# EAGLE design SparkFun_CP2103_Breakout (EAGLE 7.2.0)
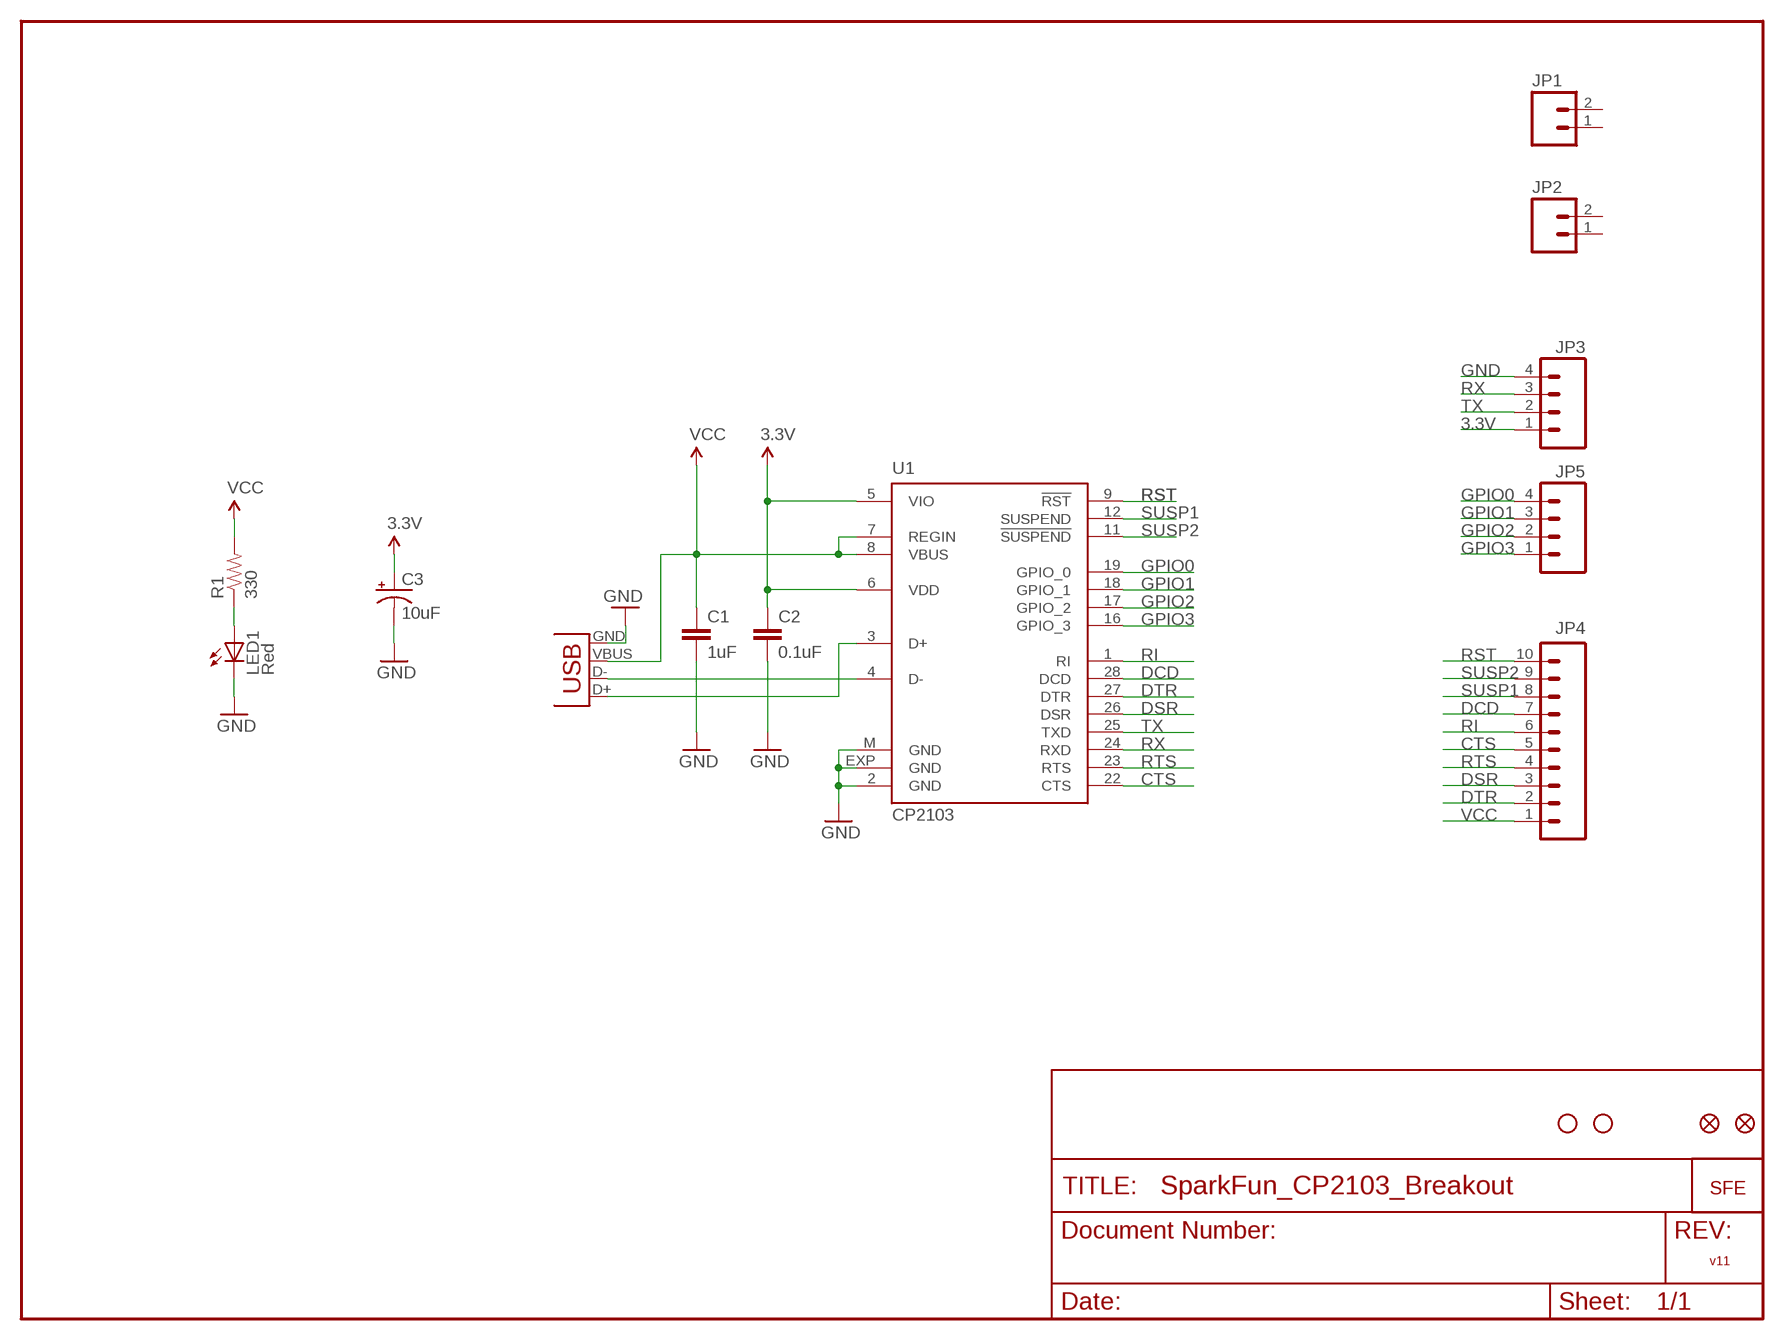
[diagram p0: schematic, sheet 1]

## Parts
C1  1uF  CAP0402  [C0402]
C2  0.1uF  CAP0402  [C0402]
C3  10uF  CAP_POL1206  [EIA3216]
JP1  M02PTH  [1X02]
JP2  M02PTH  [1X02]
JP3  M04PTH  [1X04]
JP4  M100.1  [1X10]
JP5  M04PTH  [1X04]
LED1  Red  LED1206  [LED-1206]
R1  330  RESISTOR0402  [C0402]
U1  CP2103  CP2103_USB_UART  [MLP28]
U$1  LOGO-SFENEW  [SFE-NEW-WEBLOGO]
U$2  FIDUCIAL1X2  [FIDUCIAL-1X2]
U$3  FIDUCIAL1X2  [FIDUCIAL-1X2]
U$6  STAND-OFF  [STAND-OFF]
U$7  STAND-OFF  [STAND-OFF]
X1  USBPTH  [USB-B-PTH]

## Nets
3.3V: C2.1 C3.A(+) JP3.1 U1.5(VIO) U1.6(VDD)
CTS: JP4.5 U1.22(CTS)
D+: U1.3(D+) X1.D+
D-: U1.4(D-) X1.D-
DCD: JP4.7 U1.28(DCD)
DSR: JP4.3 U1.26(DSR)
DTR: JP4.2 U1.27(DTR)
GND: C1.2 C2.2 C3.C(-) JP3.4 LED1.C U1.2(GND) U1.EXP(GND) U1.M(GND) X1.GND
GPIO0: JP5.4 U1.19(GPIO_0)
GPIO1: JP5.3 U1.18(GPIO_1)
GPIO2: JP5.2 U1.17(GPIO_2)
GPIO3: JP5.1 U1.16(GPIO_3)
N$3: LED1.A R1.1
RI: JP4.6 U1.1(RI)
RST: JP4.10 U1.9(!RST)
RTS: JP4.4 U1.23(RTS)
RX: JP3.3 U1.24(RXD)
SUSP1: JP4.8 U1.12(SUSPEND)
SUSP2: JP4.9 U1.11(!SUSPEND)
TX: JP3.2 U1.25(TXD)
VCC: C1.1 JP4.1 R1.2 U1.7(REGIN) U1.8(VBUS) X1.VBUS
Unconnected: JP1.1 JP1.2 JP2.1 JP2.2

## Notes on the sheet
- v11

## Library data of the parts
C1 C2 = SparkFun:CAP: Capacitor Standard 0603 ceramic capacitor, and 0.1" leaded capacitor.
C3 = SparkFun:CAP_POL: Capacitor Polarized These are standard SMD and PTH capacitors. Normally 10uF, 47uF, and 100uF in electrolytic and tantalum varieties. Always verify the external diameter of the through hole cap, it varies with capacity, voltage, and manufacturer. The EIA devices should be standard.
JP1 JP2 = SparkFun:M02: Header 2 Standard 2-pin 0.1" header. Use with straight break away headers (SKU : PRT-00116), right angle break away headers (PRT-00553), swiss pins (PRT-00743), machine pins (PRT-00117), and female headers (PRT-00115). Molex polarized connector foot print use with SKU : PRT-08233 with associated crimp pins and housings.
JP3 JP5 = SparkFun:M04: Header 4 Standard 4-pin 0.1" header. Use with straight break away headers (SKU : PRT-00116), right angle break away headers (PRT-00553), swiss pins (PRT-00743), machine pins (PRT-00117), and female headers (PRT-00115). Molex polarized connector foot print use with SKU : PRT-08231 with associated crimp pins and housings.
JP4 = SparkFun:M10: Header 10 Standard 10-pin 0.1" header. Use with straight break away headers (SKU : PRT-00116), right angle break away headers (PRT-00553), swiss pins (PRT-00743), machine pins (PRT-00117), and female headers (PRT-00115).
LED1 = SparkFun:LED: LEDs Standard schematic elements and footprints for 5mm, 3mm, 1206, and 0603 sized LEDs. 5mm - Spark Fun Electronics SKU : COM-00529 (and others)
R1 = SparkFun:RESISTOR: Resistor Basic schematic elements and footprints for 0603, 1206, and PTH 1/10th watt (small) resistors.
U1 = SparkFun:CP2103_USB_UART: Single-Chip USB to UART Bridge Source: www.silabs.com .. CP2103.pdf. Spark Fun Electronics SKU : COM-00309
U$1 = SparkFun:LOGO-SFE: Spark Fun Electronics PCB Logo This is the standard Spark Fun Electronics PCB logo.
U$2 U$3 = SparkFun:FIDUCIAL: Fiducial Alignment Points Various fiducial points for machine vision alignment.
U$6 U$7 = SparkFun:STAND-OFF: Stand Off This is the mechanical footprint for a #4 phillips button head screw. Use the keepout ring to avoid running the screw head into surrounding components. SKU : PRT-00447
X1 = SparkFun:USB: USB Connectors USB-B-PTH is fully proven SKU : PRT-00139 USB-miniB is fully proven SKU : PRT-00587 USB-A-PCB is untested. USB-A-H is throughly reviewed, but untested. Spark Fun Electronics SKU : PRT-00437 USB-B-SMT is throughly reviewed, but untested. Needs silkscreen touching up. USB-A-S has not been used/tested USB-MB-H has not been used/tested

## Board
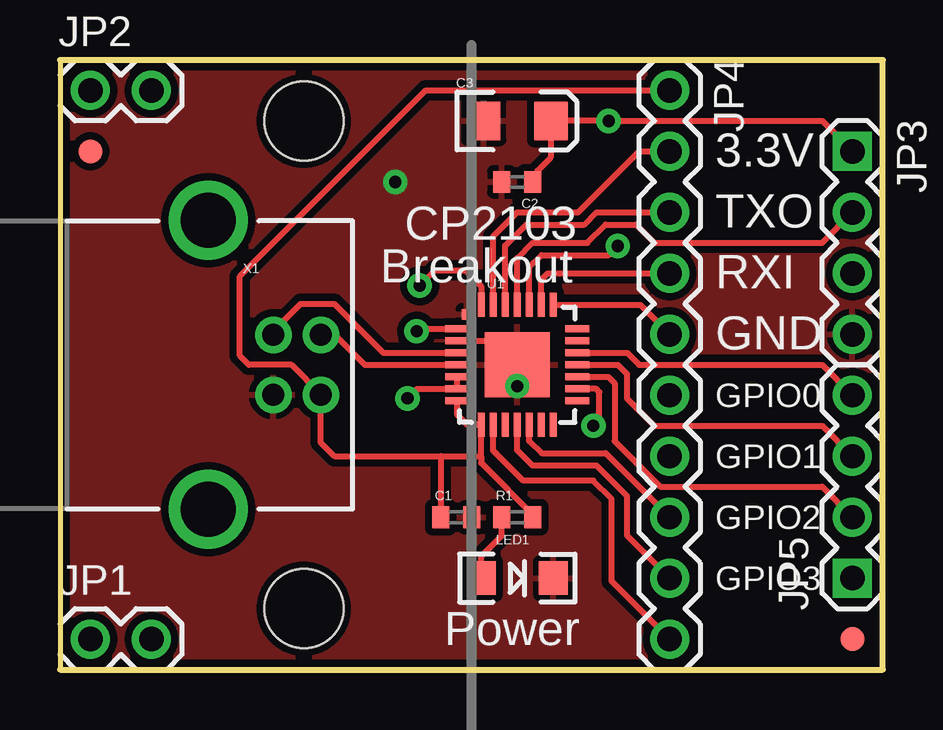
[diagram p1: board, top side]
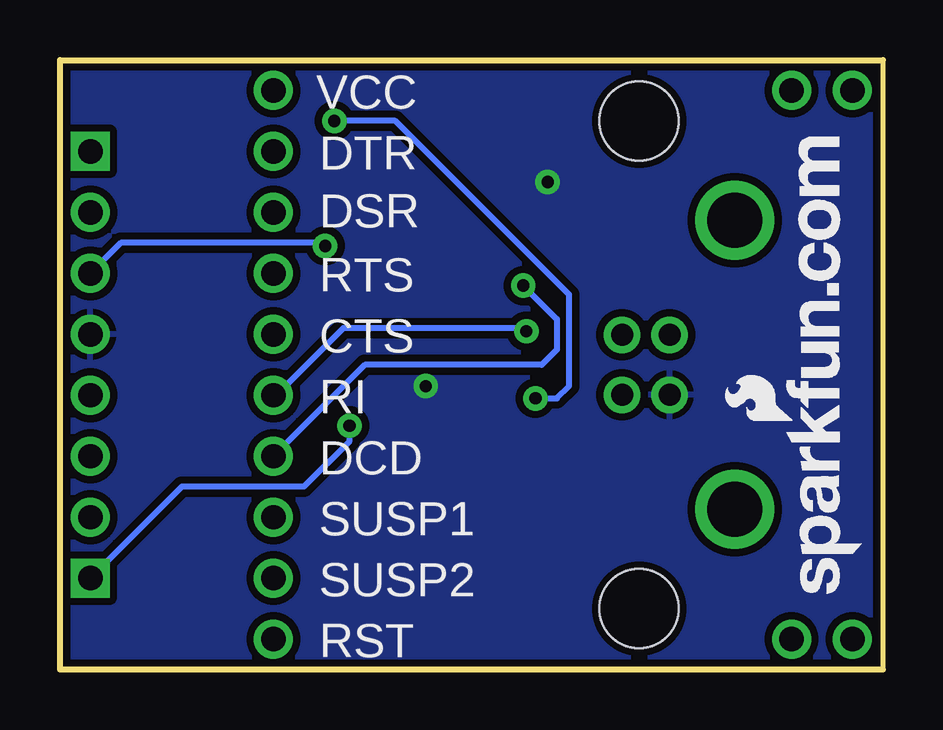
[diagram p2: board, bottom side, seen from below]

Size 34.29 x 25.4 mm. Coordinates in mm from the lower left corner, seen from the top.
Outline: 0,0 34.29,0 34.29,25.4 0,25.4 0,0
Copper layers (1*16): Top 0.035mm / dielectric 1.5mm / Bottom 0.035mm
Design rules "SparkFun": minimum track width 8mil, minimum drill 20mil, track to track 8mil, track to pad 8mil, pad to pad 8mil, via to via 8mil, smd to smd 8mil, copper to edge 10mil, drill to drill 8mil, minimum pad ring 12mil, minimum via ring 10mil, stop-mask expansion 4mil, vias tented up to drill 20mil, thermal gap 10mil

### Footprints (pad centres in the part's own frame; a part is rotated, then mirrored left to right if it is on the bottom)
C0402 = smd 0.7 x 0.9: 1 -0.65,0; 2 0.65,0
EIA3216 = smd 1.4 x 1.6: A 1.4,0; C -1.4,0
1X02 = drill 1.016: 1 0,0; 2 2.54,0
1X04 = drill 1.016 square: 1 0,0 | drill 1.016: 2 2.54,0; 3 5.08,0; 4 7.62,0
1X10 = drill 1.016: 1 0,0; 2 2.54,0; 3 5.08,0; 4 7.62,0; 5 10.16,0; 6 12.7,0; 7 15.24,0; 8 17.78,0; 9 20.32,0; 10 22.86,0
LED-1206 = smd 1.2 x 1.4: A -1.5,0; C 1.5,0
MLP28 = smd 1 x 0.3: 1 -2.5,1.5; 2 -2.5,1; 3 -2.5,0.5; 4 -2.5,0; 5 -2.5,-0.5; 6 -2.5,-1; 7 -2.5,-1.5; 15 2.5,-1.5; 16 2.5,-1; 17 2.5,-0.5; 18 2.5,0; 19 2.5,0.5; 20 2.5,1; 21 2.5,1.5 | smd 0.3 x 1: 8 -1.5,-2.5; 9 -1,-2.5; 10 -0.5,-2.5; 11 0,-2.5; 12 0.5,-2.5; 13 1,-2.5; 14 1.5,-2.5; 22 1.5,2.5; 23 1,2.5; 24 0.5,2.5; 25 0,2.5; 26 -0.5,2.5; 27 -1,2.5; 28 -1.5,2.5 | smd 2.7 x 2.7: EXP 0,0 | smd 0.435 x 0.435: M -2.103,2.103
FIDUCIAL-1X2 = smd 1 x 1: 1 0,0
STAND-OFF = hole 3.302: 0,0
USB-B-PTH = drill 0.914: D+ 0,1.25; D- 1.981,1.25; GND 0,-1.25; VBUS 1.981,-1.25 | drill 2.286: P$1 -2.718,-6.02; P$2 -2.718,6.02

### Placement (x,y rotation side)
C1  16.51,6.35 0 top
C2  19.05,20.32 180 top
C3  19.05,22.86 0 top
JP1  1.27,1.27 0 top
JP2  1.27,24.13 0 top
JP3  33.02,21.59 270 top
JP4  25.4,24.13 270 top
JP5  33.02,3.81 90 top
LED1  19.05,3.81 0 top
R1  19.05,6.35 0 top
U1  19.05,12.7 0 top
U$1  0.89,3.17 90 bottom
U$2  33.02,1.27 0 top
U$3  1.27,21.59 0 top
U$6  10.16,2.54 0 top
U$7  10.16,22.86 0 top
X1  8.89,12.7 0 top

### Tracks (layer width: path | path; a pad name or v marks a point on that pad's centre or on a via)
3.3V  (via drill 0.51)
  Top 0.254: C2.1 19.9,20.79 20.45,21.34 20.45,22.73 20.45,22.74 C3.A v22.86,22.86 31.75,22.86 JP3.1 | v14.48,11.3 14.88,11.7 U1.6 16.53,11.7 | 16.53,11.7 16.51,11.68 | U1.5 16.55,11.72 16.53,11.7
  Bottom 0.254: 14.22,11.3 v14.48,11.3 13.59,11.3 13.08,11.81 13.08,15.62 20.32,22.86 v22.86,22.86
CTS
  Top 0.254: U1.22 24.17,15.2 JP4.5
D+
  Top 0.254: X1.D+ 8.89,14.1 10.03,15.24 11.43,15.24 13.47,13.2 U1.3
D-
  Top 0.254: U1.4 12.7,12.7 11.45,13.95 X1.D-
DCD  (via drill 0.51)
  Top 0.254: U1.28 17.55,15.98 16.89,16.64 15.62,16.64 v14.99,16
  Bottom 0.254: JP4.7 21.59,12.7 14.22,12.7 13.59,13.34 13.59,14.61 v14.99,16
DSR
  Top 0.254: JP4.3 22.35,19.05 21.84,18.54 19.43,18.54 18.55,17.66 U1.26
DTR
  Top 0.254: JP4.2 24.13,21.59 21.59,19.05 19.05,19.05 18.05,18.05 U1.27
GND  (via drill 0.51)
  Top 0.254: U1.EXP 19.05,13.08 18.43,13.7 U1.2
  other vias: 13.97,20.32 19.05,11.81
  pour Bottom (isolate 0.305): 0,0 0,25.4 34.29,25.4 34.29,0
  pour Top (isolate 0.305): 0,0 0,25.4 34.29,25.4 34.29,0
GPIO0
  Top 0.254: U1.19 23.63,13.2 24.13,12.7 31.75,12.7 JP5.4
GPIO1
  Top 0.254: U1.18 23.24,12.7 23.62,12.32 23.62,11.3 24.77,10.16 31.75,10.16 JP5.3
GPIO2
  Top 0.254: U1.17 22.85,12.2 23.11,11.94 23.11,9.53 25.02,7.62 31.75,7.62 JP5.2
GPIO3  (via drill 0.51)
  Top 0.254: U1.16 22.34,11.7 22.48,11.56 22.48,10.41 v22.23,10.16
  Bottom 0.254: v22.23,10.16 22.23,9.53 24.13,7.62 29.21,7.62 JP5.1
N$3
  Top 0.254: LED1.A 17.55,4.72 18.4,5.57 R1.1
RI  (via drill 0.51)
  Top 0.254: U1.1 14.88,14.2 v14.86,14.1
  Bottom 0.254: JP4.6 25.27,11.43 22.48,14.22 14.99,14.22 v14.86,14.1
RST
  Top 0.254: JP4.10 22.99,3.68 22.99,7.11 22.23,7.87 19.3,7.87 18.16,9.02 18.05,9.13 U1.9
RTS
  Top 0.254: U1.23 20.05,16.24 20.32,16.51 JP4.4
RX  (via drill 0.51)
  Top 0.254: v23.24,17.65 22.86,17.27 20.07,17.27 19.55,16.76 U1.24
  Bottom 0.254: v23.24,17.65 23.37,17.78 31.75,17.78 JP3.3
SUSP1
  Top 0.254: JP4.8 22.73,9.02 20.07,9.02 19.56,9.53 19.55,9.53 U1.12
SUSP2
  Top 0.254: JP4.9 23.62,5.59 23.62,7.24 22.35,8.51 19.68,8.51 19.05,9.14 U1.11
TX
  Top 0.254: JP3.2 31.75,17.78 24.77,17.78 24,18.54 22.73,18.54 21.97,17.78 19.68,17.78 19.05,17.14 U1.25
VCC
  Top 0.254: 15.75,6.35 C1.1 15.86,8.88 15.88,8.89 | JP4.1 15.24,24.13 7.49,16.38 7.49,13.08 7.87,12.7 9.65,12.7 10.87,11.48 X1.VBUS 10.87,9.45 11.43,8.89 15.88,8.89 | 15.88,8.89 17.53,8.89 | R1.2 19.81,6.35 17.55,8.61 17.55,8.89 17.53,8.89 | 17.53,8.89 17.55,8.91 U1.8 16.98,10.2 16.55,10.63 U1.7

### Text on the board
tPlace: 3.3V | CP2103 | TXO | Breakout | RXI | GND | GPIO0 | GPIO1 | GPIO2 | GPIO3 | Power
bPlace: VCC | DTR | DSR | RTS | CTS | RI | DCD | SUSP1 | SUSP2 | RST